# EAGLE design FlightPCB (EAGLE 9.6.2)
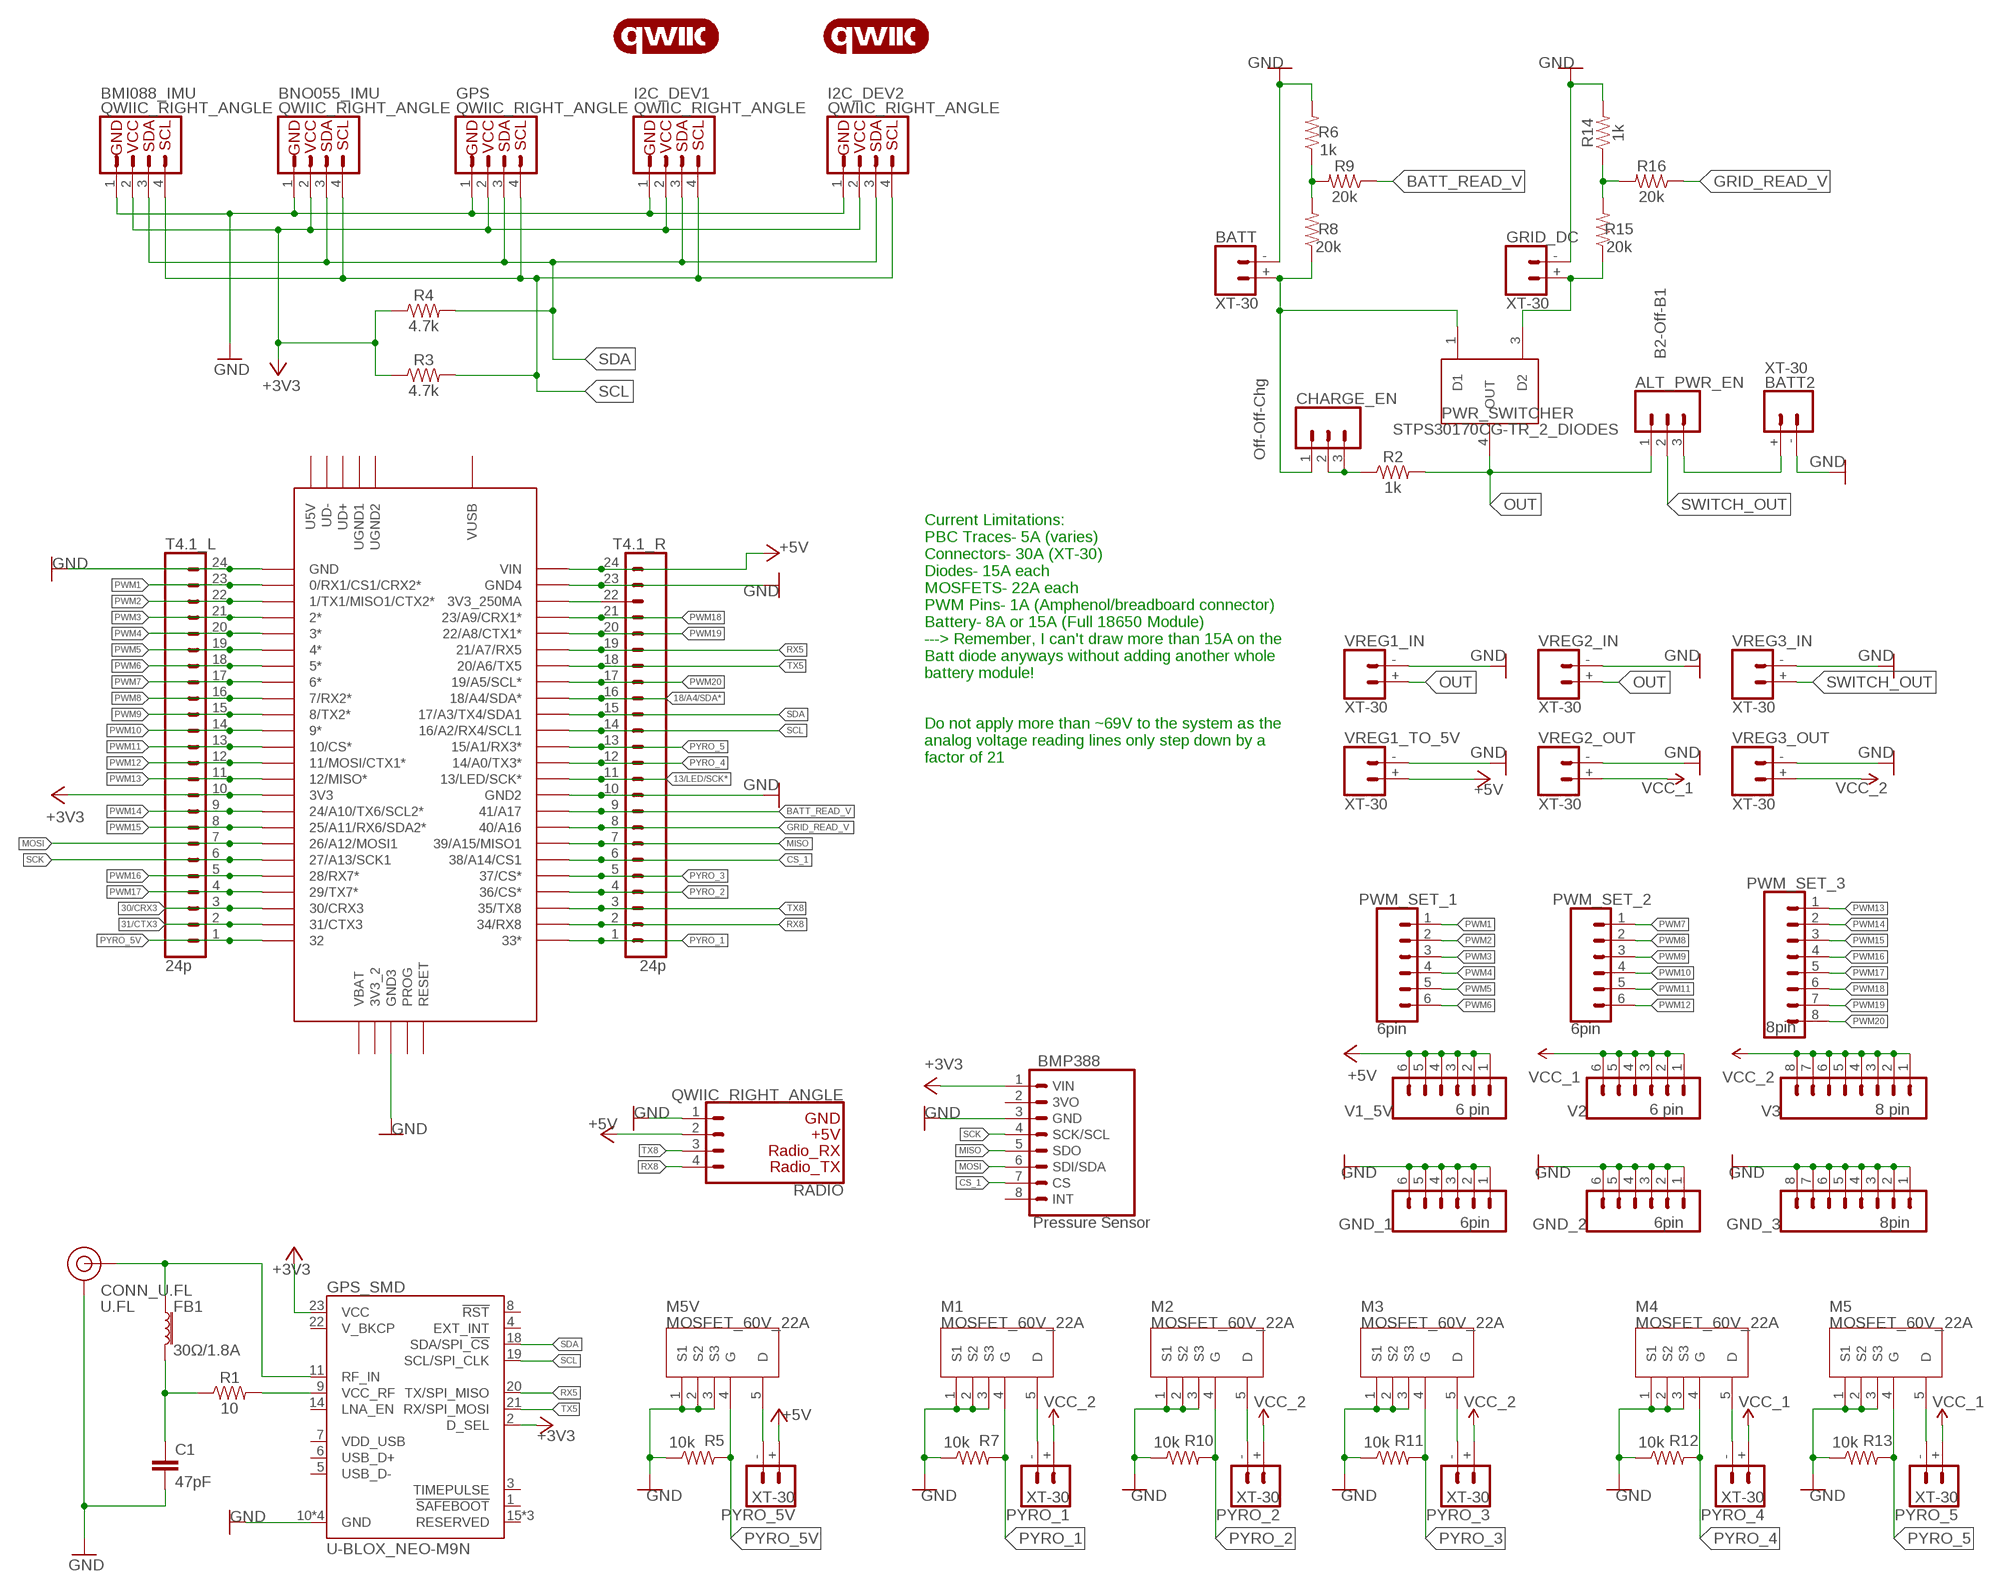
[diagram p0: schematic, sheet 1]

## Parts
ALT_PWR_EN  B2-Off-B1  CONN_03_SLIDE_SWITCH_EG5137  [1X03_SLIDE_SWITCH_EG5137]
BATT  XT-30  CONN_02_XT-30_CONNECTOR1X02_XT-30  [1X02_BIG_XT-30]
BATT2  XT-30  CONN_02_XT-30_CONNECTOR1X02_XT-30  [1X02_BIG_XT-30]
BMI088_IMU  QWIIC_RIGHT_ANGLE  QWIIC_CONNECTORJS-1MM  [JST04_1MM_RA]
BMP388  Pressure Sensor  CONN_08_BMP388_MODIFIEDFEMALE_LOCK  [1X08_FEMALE_LOCK]
BNO055_IMU  QWIIC_RIGHT_ANGLE  QWIIC_CONNECTORJS-1MM  [JST04_1MM_RA]
C1  47pF  47PF-0603-50V-5%  [0603]
CHARGE_EN  Off-Off-Chg  CONN_03_SLIDE_SWITCH_EG5137  [1X03_SLIDE_SWITCH_EG5137]
CONN_U.FL  U.FL  U.FL2PIN  [U.FL]
FB1  30Ω/1.8A  FERRITE_BEAD-0603  [0603]
GND_1  6pin  CONN_06LOCK  [1X06_LOCK]
GND_2  6pin  CONN_06LOCK  [1X06_LOCK]
GND_3  8pin  CONN_08LOCK  [1X08_LOCK]
GPS  QWIIC_RIGHT_ANGLE  QWIIC_CONNECTORJS-1MM  [JST04_1MM_RA]
GPS_SMD  U-BLOX_NEO-M9N  [NEO-M9N/M8T/M8U]
GRID_DC  XT-30  CONN_02_XT-30_CONNECTOR1X02_XT-30  [1X02_BIG_XT-30]
I2C_DEV1  QWIIC_RIGHT_ANGLE  QWIIC_CONNECTORJS-1MM  [JST04_1MM_RA]
I2C_DEV2  QWIIC_RIGHT_ANGLE  QWIIC_CONNECTORJS-1MM  [JST04_1MM_RA]
LOGO1  QWIIC_LOGO_CONNECTOR  [QWIIC_5.5MM]
LOGO2  QWIIC_LOGO_CONNECTOR  [QWIIC_5.5MM]
M1  MOSFET_60V_22A  [TO127P600X120-5N]
M2  MOSFET_60V_22A  [TO127P600X120-5N]
M3  MOSFET_60V_22A  [TO127P600X120-5N]
M4  MOSFET_60V_22A  [TO127P600X120-5N]
M5  MOSFET_60V_22A  [TO127P600X120-5N]
M5V  MOSFET_60V_22A  [TO127P600X120-5N]
PWM_SET_1  6pin  CONN_06LOCK  [1X06_LOCK]
PWM_SET_2  6pin  CONN_06LOCK  [1X06_LOCK]
PWM_SET_3  8pin  CONN_08LOCK  [1X08_LOCK]
PWR_SWITCHER  STPS30170CG-TR_2_DIODES  [TO-263-3_PACKAGE_MIDDLE_PIN_REMOVED]
PYRO_1  XT-30  CONN_02_XT-30_CONNECTOR1X02_XT-30  [1X02_BIG_XT-30]
PYRO_2  XT-30  CONN_02_XT-30_CONNECTOR1X02_XT-30  [1X02_BIG_XT-30]
PYRO_3  XT-30  CONN_02_XT-30_CONNECTOR1X02_XT-30  [1X02_BIG_XT-30]
PYRO_4  XT-30  CONN_02_XT-30_CONNECTOR1X02_XT-30  [1X02_BIG_XT-30]
PYRO_5  XT-30  CONN_02_XT-30_CONNECTOR1X02_XT-30  [1X02_BIG_XT-30]
PYRO_5V  XT-30  CONN_02_XT-30_CONNECTOR1X02_XT-30  [1X02_BIG_XT-30]
R1  10  10OHM-0603-1/10W-1%  [0603]
R2  1k  1KOHM-0603-1/10W-1%  [0603]
R3  4.7k  4.7KOHM-0603-1/10W-1%  [0603]
R4  4.7k  4.7KOHM-0603-1/10W-1%  [0603]
R5  10k  10KOHM-0603-1/10W-1%  [0603]
R6  1k  1KOHM-0603-1/10W-1%  [0603]
R7  10k  10KOHM-0603-1/10W-1%  [0603]
R8  20k  20KOHM-0603-1/10W-1%  [0603]
R9  20k  20KOHM-0603-1/10W-1%  [0603]
R10  10k  10KOHM-0603-1/10W-1%  [0603]
R11  10k  10KOHM-0603-1/10W-1%  [0603]
R12  10k  10KOHM-0603-1/10W-1%  [0603]
R13  10k  10KOHM-0603-1/10W-1%  [0603]
R14  1k  1KOHM-0603-1/10W-1%  [0603]
R15  20k  20KOHM-0603-1/10W-1%  [0603]
R16  20k  20KOHM-0603-1/10W-1%  [0603]
RADIO  QWIIC_RIGHT_ANGLE  QWIIC_CONNECTOR_SERIAL_RADIO_MODIFIEDJS-1MM  [JST04_1MM_RA]
T4.1_L  24p  CONN_24LOCK  [1X24_LOCK]
T4.1_R  24p  CONN_24LOCK  [1X24_LOCK]
TEENSY_4.1  TEENSY_4.1  [TEENSY_4.1]
V1_5V  6 pin  CONN_06LOCK  [1X06_LOCK]
V2  6 pin  CONN_06LOCK  [1X06_LOCK]
V3  8 pin  CONN_08LOCK  [1X08_LOCK]
VREG1_IN  XT-30  CONN_02_XT-30_CONNECTOR1X02_XT-30  [1X02_BIG_XT-30]
VREG1_TO_5V  XT-30  CONN_02_XT-30_CONNECTOR1X02_XT-30  [1X02_BIG_XT-30]
VREG2_IN  XT-30  CONN_02_XT-30_CONNECTOR1X02_XT-30  [1X02_BIG_XT-30]
VREG2_OUT  XT-30  CONN_02_XT-30_CONNECTOR1X02_XT-30  [1X02_BIG_XT-30]
VREG3_IN  XT-30  CONN_02_XT-30_CONNECTOR1X02_XT-30  [1X02_BIG_XT-30]
VREG3_OUT  XT-30  CONN_02_XT-30_CONNECTOR1X02_XT-30  [1X02_BIG_XT-30]

## Nets
13/LED/SCK*: T4.1_R.11 TEENSY_4.1.13/LED/SCK*
18/A4/SDA*: T4.1_R.16 TEENSY_4.1.18/A4/SDA*
30/CRX3: T4.1_L.3 TEENSY_4.1.30/CRX3
31/CTX3: T4.1_L.2 TEENSY_4.1.31/CTX3
+3V3: BMI088_IMU.2 BMP388.1(VIN) BNO055_IMU.2 GPS.2 GPS_SMD.2(D_SEL) GPS_SMD.23(VCC) I2C_DEV1.2 I2C_DEV2.2 R3.1 R4.1 T4.1_L.10 TEENSY_4.1.3V3
+5V: PYRO_5V.+ RADIO.2 T4.1_R.24 TEENSY_4.1.VIN V1_5V.1 V1_5V.2 V1_5V.3 V1_5V.4 V1_5V.5 V1_5V.6 VREG1_TO_5V.+
BATT_READ_V: R9.1 T4.1_R.9 TEENSY_4.1.41/A17
CS_1: BMP388.7(CS) T4.1_R.6 TEENSY_4.1.38/A14/CS1
GND: BATT2.- BATT.- BMI088_IMU.1 BMP388.3(GND) BNO055_IMU.1 C1.2 CONN_U.FL.1(GND) CONN_U.FL.2(GND) GND_1.1 GND_1.2 GND_1.3 GND_1.4 GND_1.5 GND_1.6 GND_2.1 GND_2.2 GND_2.3 GND_2.4 GND_2.5 GND_2.6 GND_3.1 GND_3.2 GND_3.3 GND_3.4 GND_3.5 GND_3.6 GND_3.7 GND_3.8 GPS.1 GPS_SMD.10(GND) GPS_SMD.12(GND) GPS_SMD.13(GND) GPS_SMD.24(GND) GRID_DC.- I2C_DEV1.1 I2C_DEV2.1 M1.1(S1) M1.2(S2) M1.3(S3) M2.1(S1) M2.2(S2) M2.3(S3) M3.1(S1) M3.2(S2) M3.3(S3) M4.1(S1) M4.2(S2) M4.3(S3) M5.1(S1) M5.2(S2) M5.3(S3) M5V.1(S1) M5V.2(S2) M5V.3(S3) R5.1 R6.2 R7.1 R10.1 R11.1 R12.1 R13.1 R14.2 RADIO.1 T4.1_L.24 T4.1_R.10 T4.1_R.23 TEENSY_4.1.GND TEENSY_4.1.GND2 TEENSY_4.1.GND3 TEENSY_4.1.GND4 VREG1_IN.- VREG1_TO_5V.- VREG2_IN.- VREG2_OUT.- VREG3_IN.- VREG3_OUT.-
GRID_READ_V: R16.1 T4.1_R.8 TEENSY_4.1.40/A16
MISO: BMP388.5(SDO) T4.1_R.7 TEENSY_4.1.39/A15/MISO1
MOSI: BMP388.6(SDI/SDA) T4.1_L.7 TEENSY_4.1.26/A12/MOSI1
N$1: CONN_U.FL.FEED(SIGNAL) FB1.1 GPS_SMD.11(RF_IN)
N$2: C1.1 FB1.2 R1.1
N$3: GPS_SMD.9(VCC_RF) R1.2
N$4: CHARGE_EN.2 CHARGE_EN.3 R2.1
N$5: ALT_PWR_EN.3 BATT2.+
N$6: R6.1 R8.2 R9.2
N$7: M5V.5(D) PYRO_5V.-
N$8: GRID_DC.+ PWR_SWITCHER.3(D2) R15.1
N$9: M1.5(D) PYRO_1.-
N$10: M2.5(D) PYRO_2.-
N$11: M3.5(D) PYRO_3.-
N$12: M4.5(D) PYRO_4.-
N$13: M5.5(D) PYRO_5.-
N$14: BATT.+ CHARGE_EN.1 PWR_SWITCHER.1(D1) R8.1
N$16: R14.1 R15.2 R16.2
N$66: T4.1_R.22 TEENSY_4.1.3V3_250MA
OUT: ALT_PWR_EN.1 PWR_SWITCHER.4(OUT) R2.2 VREG1_IN.+ VREG2_IN.+
PWM1: PWM_SET_1.1 T4.1_L.23 TEENSY_4.1.0/RX1/CS1/CRX2*
PWM2: PWM_SET_1.2 T4.1_L.22 TEENSY_4.1.1/TX1/MISO1/CTX2*
PWM3: PWM_SET_1.3 T4.1_L.21 TEENSY_4.1.2*
PWM4: PWM_SET_1.4 T4.1_L.20 TEENSY_4.1.3*
PWM5: PWM_SET_1.5 T4.1_L.19 TEENSY_4.1.4*
PWM6: PWM_SET_1.6 T4.1_L.18 TEENSY_4.1.5*
PWM7: PWM_SET_2.1 T4.1_L.17 TEENSY_4.1.6*
PWM8: PWM_SET_2.2 T4.1_L.16 TEENSY_4.1.7/RX2*
PWM9: PWM_SET_2.3 T4.1_L.15 TEENSY_4.1.8/TX2*
PWM10: PWM_SET_2.4 T4.1_L.14 TEENSY_4.1.9*
PWM11: PWM_SET_2.5 T4.1_L.13 TEENSY_4.1.10/CS*
PWM12: PWM_SET_2.6 T4.1_L.12 TEENSY_4.1.11/MOSI/CTX1*
PWM13: PWM_SET_3.1 T4.1_L.11 TEENSY_4.1.12/MISO*
PWM14: PWM_SET_3.2 T4.1_L.9 TEENSY_4.1.24/A10/TX6/SCL2*
PWM15: PWM_SET_3.3 T4.1_L.8 TEENSY_4.1.25/A11/RX6/SDA2*
PWM16: PWM_SET_3.4 T4.1_L.5 TEENSY_4.1.28/RX7*
PWM17: PWM_SET_3.5 T4.1_L.4 TEENSY_4.1.29/TX7*
PWM18: PWM_SET_3.6 T4.1_R.21 TEENSY_4.1.23/A9/CRX1*
PWM19: PWM_SET_3.7 T4.1_R.20 TEENSY_4.1.22/A8/CTX1*
PWM20 [Power Delivery]: PWM_SET_3.8 T4.1_R.17 TEENSY_4.1.19/A5/SCL*
PYRO_1: M1.4(G) R7.2 T4.1_R.1 TEENSY_4.1.33*
PYRO_2: M2.4(G) R10.2 T4.1_R.4 TEENSY_4.1.36/CS*
PYRO_3: M3.4(G) R11.2 T4.1_R.5 TEENSY_4.1.37/CS*
PYRO_4: M4.4(G) R12.2 T4.1_R.12 TEENSY_4.1.14/A0/TX3*
PYRO_5: M5.4(G) R13.2 T4.1_R.13 TEENSY_4.1.15/A1/RX3*
PYRO_5V: M5V.4(G) R5.2 T4.1_L.1 TEENSY_4.1.32
RX5: GPS_SMD.20(TX/SPI_MISO) T4.1_R.19 TEENSY_4.1.21/A7/RX5
RX8: RADIO.4 T4.1_R.2 TEENSY_4.1.34/RX8
SCK: BMP388.4(SCK/SCL) T4.1_L.6 TEENSY_4.1.27/A13/SCK1
SCL: BMI088_IMU.4 BNO055_IMU.4 GPS.4 GPS_SMD.19(SCL/SPI_CLK) I2C_DEV1.4 I2C_DEV2.4 R3.2 T4.1_R.14 TEENSY_4.1.16/A2/RX4/SCL1
SDA: BMI088_IMU.3 BNO055_IMU.3 GPS.3 GPS_SMD.18(SDA/SPI_!CS!) I2C_DEV1.3 I2C_DEV2.3 R4.2 T4.1_R.15 TEENSY_4.1.17/A3/TX4/SDA1
SWITCH_OUT: ALT_PWR_EN.2 VREG3_IN.+
TX5: GPS_SMD.21(RX/SPI_MOSI) T4.1_R.18 TEENSY_4.1.20/A6/TX5
TX8: RADIO.3 T4.1_R.3 TEENSY_4.1.35/TX8
VCC_1: PYRO_4.+ PYRO_5.+ V2.1 V2.2 V2.3 V2.4 V2.5 V2.6 VREG2_OUT.+
VCC_2: PYRO_1.+ PYRO_2.+ PYRO_3.+ V3.1 V3.2 V3.3 V3.4 V3.5 V3.6 V3.7 V3.8 VREG3_OUT.+
Unconnected: BMP388.2(3VO) BMP388.8(INT) GPS_SMD.1(!SAFEBOOT!) GPS_SMD.3(TIMEPULSE) GPS_SMD.4(EXT_INT) GPS_SMD.5(USB_D-) GPS_SMD.6(USB_D+) GPS_SMD.7(VDD_USB) GPS_SMD.8(!RST) GPS_SMD.14(LNA_EN) GPS_SMD.15(RESERVED) GPS_SMD.16(RESERVED) GPS_SMD.17(RESERVED) GPS_SMD.22(V_BKCP) TEENSY_4.1.3V3_2 TEENSY_4.1.PROG TEENSY_4.1.RESET TEENSY_4.1.U5V TEENSY_4.1.UD+ TEENSY_4.1.UD- TEENSY_4.1.UGND1 TEENSY_4.1.UGND2 TEENSY_4.1.VBAT TEENSY_4.1.VUSB

## Notes on the sheet
- Current Limitations:
  PBC Traces- 5A (varies)
  Connectors- 30A (XT-30)
  Diodes- 15A each
  MOSFETS- 22A each
  PWM Pins- 1A (Amphenol/breadboard connector)
  Battery- 8A or 15A (Full 18650 Module)
  ---> Remember, I can't draw more than 15A on the 
  Batt diode anyways without adding another whole
  battery module!
  
  
  Do not apply more than ~69V to the system as the 
  analog voltage reading lines only step down by a 
  factor of 21

## Library data of the parts
ALT_PWR_EN CHARGE_EN = MODIFIED-SparkFun-Connectors:CONN_03_SLIDE_SWITCH_EG5137: Multi connection point. Often used as Generic Header-pin footprint for 0.1 inch spaced/style header connections On any of the 0.1 inch spaced packages, you can populate with these: Break Away Headers - Straight <https://www.sparkfun.com/products/116> (PRT-00116) Break Away Male Headers - Right Angle <https://www.sparkfun.com/products/553> (PRT-00553) Female Headers <https://www.sparkfun.com/products/115> (PRT-00115) Break Away Headers - Machine Pin <https://www.sparkfun.com/products/117> (PRT-00117) Break Away Female Headers - Swiss Machine Pin <https://www.sparkfun.com/products/743> (PRT-00743) Stackable Header - 3 Pin (Female, 0.1") <https://www.sparkfun.com/products/13875> (PRT-13875) For SCREWTERMINALS and SPRING TERMINALS visit here: Screw Terimnals on SparkFun.com <https://www.sparkfun.com/search/results?term=Screw+Terminals> (5mm/3.5mm/2.54mm spacing) This device is also useful as a general connection point to wire up your design to another part of your project. Our various solder wires solder well into these plated through hole pads. Hook-Up Wire - Assortment (Stranded, 22 AWG) <https://www.sparkfun.com/products/11375> (PRT-11375) Hook-Up Wire - Assortment (Solid Core, 22 AWG) <https://www.sparkfun.com/products/11367> (PRT-11367) View the entire wire category on our website here <https://www.sparkfun.com/categories/141> Special notes: Molex polarized connector foot print use with SKU : PRT-08232 with associated crimp pins and housings.
BATT BATT2 GRID_DC PYRO_1-PYRO_5 PYRO_5V VREG1_IN VREG1_TO_5V VREG2_IN VREG2_OUT VREG3_IN VREG3_OUT = MODIFIED-SparkFun-Connectors:CONN_02_XT-30_CONNECTOR: Multi connection point. Often used as Generic Header-pin footprint for 0.1 inch spaced/style header connections On any of the 0.1 inch spaced packages, you can populate with these: Break Away Headers - Straight <https://www.sparkfun.com/products/116> (PRT-00116) Break Away Male Headers - Right Angle <https://www.sparkfun.com/products/553> (PRT-00553) Female Headers <https://www.sparkfun.com/products/115> (PRT-00115) Break Away Headers - Machine Pin <https://www.sparkfun.com/products/117> (PRT-00117) Break Away Female Headers - Swiss Machine Pin <https://www.sparkfun.com/products/743> (PRT-00743) For SCREWTERMINALS and SPRING TERMINALS visit here: Screw Terimnals on SparkFun.com <https://www.sparkfun.com/search/results?term=Screw+Terminals> (5mm/3.5mm/2.54mm spacing) This device is also useful as a general connection point to wire up your design to another part of your project. Our various solder wires solder well into these plated through hole pads. Hook-Up Wire - Assortment (Stranded, 22 AWG) <https://www.sparkfun.com/products/11375> (PRT-11375) Hook-Up Wire - Assortment (Solid Core, 22 AWG) <https://www.sparkfun.com/products/11367> (PRT-11367) View the entire wire category on our website here <https://www.sparkfun.com/categories/141> Special notes: Molex polarized connector foot print use with: PRT-08233 with associated crimp pins and housings. 2.54_SCREWTERM for use with PRT-10571. 3.5mm Screw Terminal footprints for PRT-08084 5mm Screw Terminal footprints for use with PRT-08432
BMI088_IMU BNO055_IMU GPS I2C_DEV1 I2C_DEV2 = MODIFIED-SparkFun-Connectors:QWIIC_CONNECTOR: SparkFun I2C Standard Qwiic Connector An SMD 1mm pitch JST connector makes it easy and quick (get it? Qwiic?) to connect I2C devices to each other. The Qwiic system <http://www.sparkfun.com/qwiic> enables fast and solderless connection between popular platforms and various sensors and actuators. We carry 200mm <https://www.sparkfun.com/products/14204>, 100mm <https://www.sparkfun.com/products/14205>, 50mm <https://www.sparkfun.com/products/14206>, and breadboard friendly <https://www.sparkfun.com/products/14207> Qwiic cables. We also offer 10 pcs strips <https://www.sparkfun.com/products/14323> the SMD connectors.; PROD_ID: CONN-13694
BMP388 = MODIFIED-SparkFun-Connectors:CONN_08_BMP388_MODIFIED: Multi connection point. Often used as Generic Header-pin footprint for 0.1 inch spaced/style header connections On any of the 0.1 inch spaced packages, you can populate with these: Break Away Headers - Straight <https://www.sparkfun.com/products/116> (PRT-00116) Break Away Male Headers - Right Angle <https://www.sparkfun.com/products/553> (PRT-00553) Female Headers <https://www.sparkfun.com/products/115> (PRT-00115) Break Away Headers - Machine Pin <https://www.sparkfun.com/products/117> (PRT-00117) Break Away Female Headers - Swiss Machine Pin <https://www.sparkfun.com/products/743> (PRT-00743) Arduino Stackable Header - 8 Pin <https://www.sparkfun.com/products/9279> (PRT-09279) For SCREWTERMINALS and SPRING TERMINALS visit here: Screw Terimnals on SparkFun.com <https://www.sparkfun.com/search/results?term=Screw+Terminals> (5mm/3.5mm/2.54mm spacing) This device is also useful as a general connection point to wire up your design to another part of your project. Our various solder wires solder well into these plated through hole pads. Hook-Up Wire - Assortment (Stranded, 22 AWG) <https://www.sparkfun.com/products/11375> (PRT-11375) Hook-Up Wire - Assortment (Solid Core, 22 AWG) <https://www.sparkfun.com/products/11367> (PRT-11367) View the entire wire category on our website here <https://www.sparkfun.com/categories/141> Special notes: Molex polarized connector foot print use with SKU : PRT-08231 with associated crimp pins and housings. 1MM SMD Version SKU: PRT-10208 NOTES ON THE VARIANTS LOCK and LOCK_LONGPADS... This footprint was designed to help hold the alignment of a through-hole component (i.e. 6-pin header) while soldering it into place. You may notice that each hole has been shifted either up or down by 0.005 of an inch from it's more standard position (which is a perfectly straight line). This slight alteration caused the pins (the squares in the middle) to touch the edges of the holes. Because they are alternating, it causes a "brace" to hold the component in place. 0.005 has proven to be the perfect amount of "off-center" position when using our standard breakaway headers. Although looks a little odd when you look at the bare footprint, once you have a header in there, the alteration is very hard to notice. Also,if you push a header all the way into place, it is covered up entirely on the bottom side.; PROD_ID: CONN-09233; SF_ID: PRT-09279
C1 = SparkFun-Capacitors:47PF: 47pF ceramic capacitors A capacitor is a passive two-terminal electrical component used to store electrical energy temporarily in an electric field.; PROD_ID: CAP-08913
CONN_U.FL = MODIFIED-SparkFun-Connectors:U.FL2PIN: SMD Antenna Connector - U.FL 2mm height, 3.0mm x 3.0mm receptacle size. SparkFun Products: SparkFun WiFi Shield - ESP8266 <https://www.sparkfun.com/products/13287> SparkFun ESP8266 Thing <https://www.sparkfun.com/products/13231> SparkFun MiniGen - Pro Mini Signal Generator Shield <https://www.sparkfun.com/products/11420>; PROD_ID: CONN-09193; SF_ID: WRL-09144
FB1 = SparkFun-Coils:FERRITE_BEAD: Ferrite Bead (blocks, cores, rings, chokes, etc.) Inductor with layers of ferrite used to suppress high frequencies. Often used to isolate high frequency noise. SparkFun Products: IOIO-OTG - V2.2 <https://www.sparkfun.com/products/13613> SparkFun SAMD21 Mini Breakout <https://www.sparkfun.com/products/13664> SparkFun 6 Degrees of Freedom Breakout - LSM6DS3 <https://www.sparkfun.com/products/13339> SparkFun SAMD21 Dev Breakout <https://www.sparkfun.com/products/13672>; PROD_ID: NDUC-13805
GND_1 GND_2 PWM_SET_1 PWM_SET_2 V1_5V V2 = MODIFIED-SparkFun-Connectors:CONN_06: Multi connection point. Often used as Generic Header-pin footprint for 0.1 inch spaced/style header connections On any of the 0.1 inch spaced packages, you can populate with these: Break Away Headers - Straight <https://www.sparkfun.com/products/116> (PRT-00116) Break Away Male Headers - Right Angle <https://www.sparkfun.com/products/553> (PRT-00553) Female Headers <https://www.sparkfun.com/products/115> (PRT-00115) Break Away Headers - Machine Pin <https://www.sparkfun.com/products/117> (PRT-00117) Break Away Female Headers - Swiss Machine Pin <https://www.sparkfun.com/products/743> (PRT-00743) Arduino Stackable Header - 6 Pin <https://www.sparkfun.com/products/9280> (PRT-09280) For SCREWTERMINALS and SPRING TERMINALS visit here: Screw Terimnals on SparkFun.com <https://www.sparkfun.com/search/results?term=Screw+Terminals> (5mm/3.5mm/2.54mm spacing) This device is also useful as a general connection point to wire up your design to another part of your project. Our various solder wires solder well into these plated through hole pads. Hook-Up Wire - Assortment (Stranded, 22 AWG) <https://www.sparkfun.com/products/11375> (PRT-11375) Hook-Up Wire - Assortment (Solid Core, 22 AWG) <https://www.sparkfun.com/products/11367> (PRT-11367) View the entire wire category on our website here <https://www.sparkfun.com/categories/141>
GND_3 PWM_SET_3 V3 = MODIFIED-SparkFun-Connectors:CONN_08: Multi connection point. Often used as Generic Header-pin footprint for 0.1 inch spaced/style header connections On any of the 0.1 inch spaced packages, you can populate with these: Break Away Headers - Straight <https://www.sparkfun.com/products/116> (PRT-00116) Break Away Male Headers - Right Angle <https://www.sparkfun.com/products/553> (PRT-00553) Female Headers <https://www.sparkfun.com/products/115> (PRT-00115) Break Away Headers - Machine Pin <https://www.sparkfun.com/products/117> (PRT-00117) Break Away Female Headers - Swiss Machine Pin <https://www.sparkfun.com/products/743> (PRT-00743) Arduino Stackable Header - 8 Pin <https://www.sparkfun.com/products/9279> (PRT-09279) For SCREWTERMINALS and SPRING TERMINALS visit here: Screw Terimnals on SparkFun.com <https://www.sparkfun.com/search/results?term=Screw+Terminals> (5mm/3.5mm/2.54mm spacing) This device is also useful as a general connection point to wire up your design to another part of your project. Our various solder wires solder well into these plated through hole pads. Hook-Up Wire - Assortment (Stranded, 22 AWG) <https://www.sparkfun.com/products/11375> (PRT-11375) Hook-Up Wire - Assortment (Solid Core, 22 AWG) <https://www.sparkfun.com/products/11367> (PRT-11367) View the entire wire category on our website here <https://www.sparkfun.com/categories/141> Special notes: Molex polarized connector foot print use with SKU : PRT-08231 with associated crimp pins and housings. 1MM SMD Version SKU: PRT-10208 NOTES ON THE VARIANTS LOCK and LOCK_LONGPADS... This footprint was designed to help hold the alignment of a through-hole component (i.e. 6-pin header) while soldering it into place. You may notice that each hole has been shifted either up or down by 0.005 of an inch from it's more standard position (which is a perfectly straight line). This slight alteration caused the pins (the squares in the middle) to touch the edges of the holes. Because they are alternating, it causes a "brace" to hold the component in place. 0.005 has proven to be the perfect amount of "off-center" position when using our standard breakaway headers. Although looks a little odd when you look at the bare footprint, once you have a header in there, the alteration is very hard to notice. Also,if you push a header all the way into place, it is covered up entirely on the bottom side.
GPS_SMD = UNMODIFIED-SparkFun-GPS:U-BLOX_NEO-M9N: u-blox NEO-M9N GPS Module The NEO-M9N module is built on the robust u-blox M9 GNSS chip, which provides exceptional sensitivity and acquisition times for all L1 GNSS systems. The u-blox M9 standard precision GNSS platform, which delivers meter-level accuracy, succeeds the well-known u-blox M8 product range. The receiver also provides higher navigation rate and improved security features compared to previous u-blox GNSS generations. The NEO-M9N module is available in the NEO form factor LLC package; PROD_ID: IC-14651
LOGO1 LOGO2 = SparkFun-Aesthetics:QWIIC_LOGO: Qwiic Logos for placement on schematic and PCB. The 5.5mm silk logo is best for placing next to Qwiic connector.
M1-M5 M5V = BUK9Y43-60E:MOSFET
PWR_SWITCHER = TO-263-3_Diode_Rectifier:STPS30170CG-TR_2_DIODES
R1 = SparkFun-Resistors:10OHM: 10Ω resistor A resistor is a passive two-terminal electrical component that implements electrical resistance as a circuit element. Resistors act to reduce current flow, and, at the same time, act to lower voltage levels within circuits. - Wikipedia; PROD_ID: RES-12581
R2 R6 R14 = SparkFun-Resistors:1KOHM: 1kΩ resistor A resistor is a passive two-terminal electrical component that implements electrical resistance as a circuit element. Resistors act to reduce current flow, and, at the same time, act to lower voltage levels within circuits. - Wikipedia; PROD_ID: RES-07856
R3 R4 = SparkFun-Resistors:4.7KOHM: 4.7kΩ resistor A resistor is a passive two-terminal electrical component that implements electrical resistance as a circuit element. Resistors act to reduce current flow, and, at the same time, act to lower voltage levels within circuits. - Wikipedia; PROD_ID: RES-07857
R5 R7 R10-R13 = SparkFun-Resistors:10KOHM: 10kΩ resistor A resistor is a passive two-terminal electrical component that implements electrical resistance as a circuit element. Resistors act to reduce current flow, and, at the same time, act to lower voltage levels within circuits. - Wikipedia; PROD_ID: RES-00824
R8 R9 R15 R16 = SparkFun-Resistors:20KOHM: 20kΩ resistor A resistor is a passive two-terminal electrical component that implements electrical resistance as a circuit element. Resistors act to reduce current flow, and, at the same time, act to lower voltage levels within circuits. - Wikipedia; PROD_ID: RES-09383
RADIO = MODIFIED-SparkFun-Connectors:QWIIC_CONNECTOR_SERIAL_RADIO_MODIFIED: SparkFun I2C Standard Qwiic Connector An SMD 1mm pitch JST connector makes it easy and quick (get it? Qwiic?) to connect I2C devices to each other. The Qwiic system <http://www.sparkfun.com/qwiic> enables fast and solderless connection between popular platforms and various sensors and actuators. We carry 200mm <https://www.sparkfun.com/products/14204>, 100mm <https://www.sparkfun.com/products/14205>, 50mm <https://www.sparkfun.com/products/14206>, and breadboard friendly <https://www.sparkfun.com/products/14207> Qwiic cables. We also offer 10 pcs strips <https://www.sparkfun.com/products/14323> the SMD connectors.; PROD_ID: CONN-13694
T4.1_L T4.1_R = MODIFIED-SparkFun-Connectors:CONN_24: Multi connection point. Often used as Generic Header-pin footprint for 0.1 inch spaced/style header connections On any of the 0.1 inch spaced packages, you can populate with these: Break Away Headers - Straight <https://www.sparkfun.com/products/116> (PRT-00116) Break Away Male Headers - Right Angle <https://www.sparkfun.com/products/553> (PRT-00553) Female Headers <https://www.sparkfun.com/products/115> (PRT-00115) Break Away Headers - Machine Pin <https://www.sparkfun.com/products/117> (PRT-00117) Break Away Female Headers - Swiss Machine Pin <https://www.sparkfun.com/products/743> (PRT-00743) For SCREWTERMINALS and SPRING TERMINALS visit here: Screw Terimnals on SparkFun.com <https://www.sparkfun.com/search/results?term=Screw+Terminals> (5mm/3.5mm/2.54mm spacing) This device is also useful as a general connection point to wire up your design to another part of your project. Our various solder wires solder well into these plated through hole pads. Hook-Up Wire - Assortment (Stranded, 22 AWG) <https://www.sparkfun.com/products/11375> (PRT-11375) Hook-Up Wire - Assortment (Solid Core, 22 AWG) <https://www.sparkfun.com/products/11367> (PRT-11367) View the entire wire category on our website here <https://www.sparkfun.com/categories/141> Special notes: Molex polarized connector foot print use with SKU : PRT-08231 with associated crimp pins and housings. 1MM SMD Version SKU: PRT-10208 NOTES ON THE VARIANTS LOCK and LOCK_LONGPADS... This footprint was designed to help hold the alignment of a through-hole component (i.e. 6-pin header) while soldering it into place. You may notice that each hole has been shifted either up or down by 0.005 of an inch from it's more standard position (which is a perfectly straight line). This slight alteration caused the pins (the squares in the middle) to touch the edges of the holes. Because they are alternating, it causes a "brace" to hold the component in place. 0.005 has proven to be the perfect amount of "off-center" position when using our standard breakaway headers. Although looks a little odd when you look at the bare footprint, once you have a header in there, the alteration is very hard to notice. Also,if you push a header all the way into place, it is covered up entirely on the bottom side.
TEENSY_4.1 = Teensy4-1:TEENSY_4.1

## Net classes
1 Power Delivery: width 0.25 mm

## Board
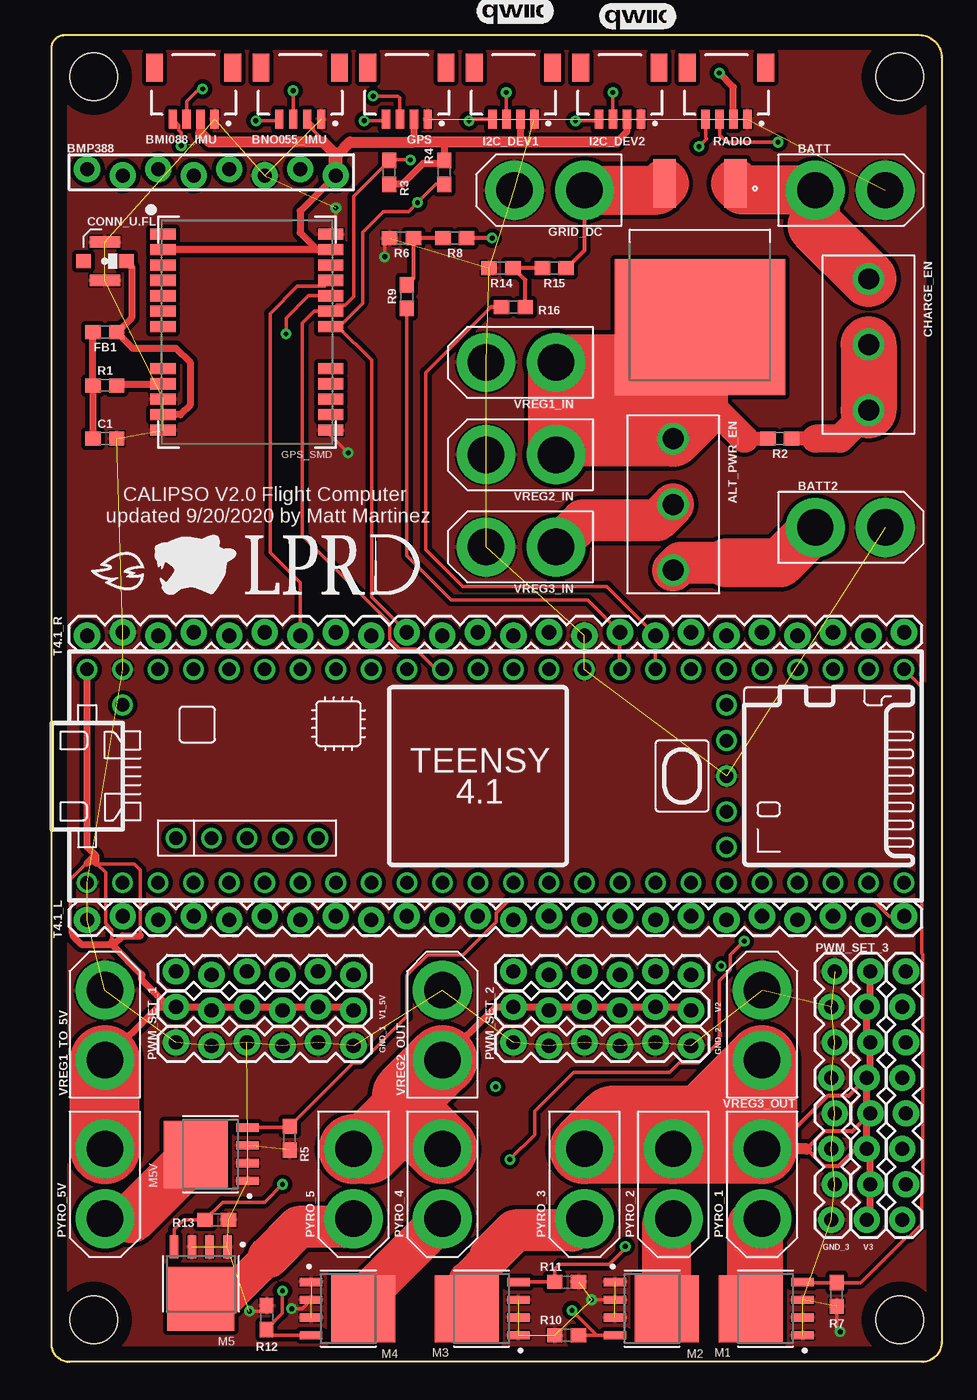
[diagram p1: board, top side]
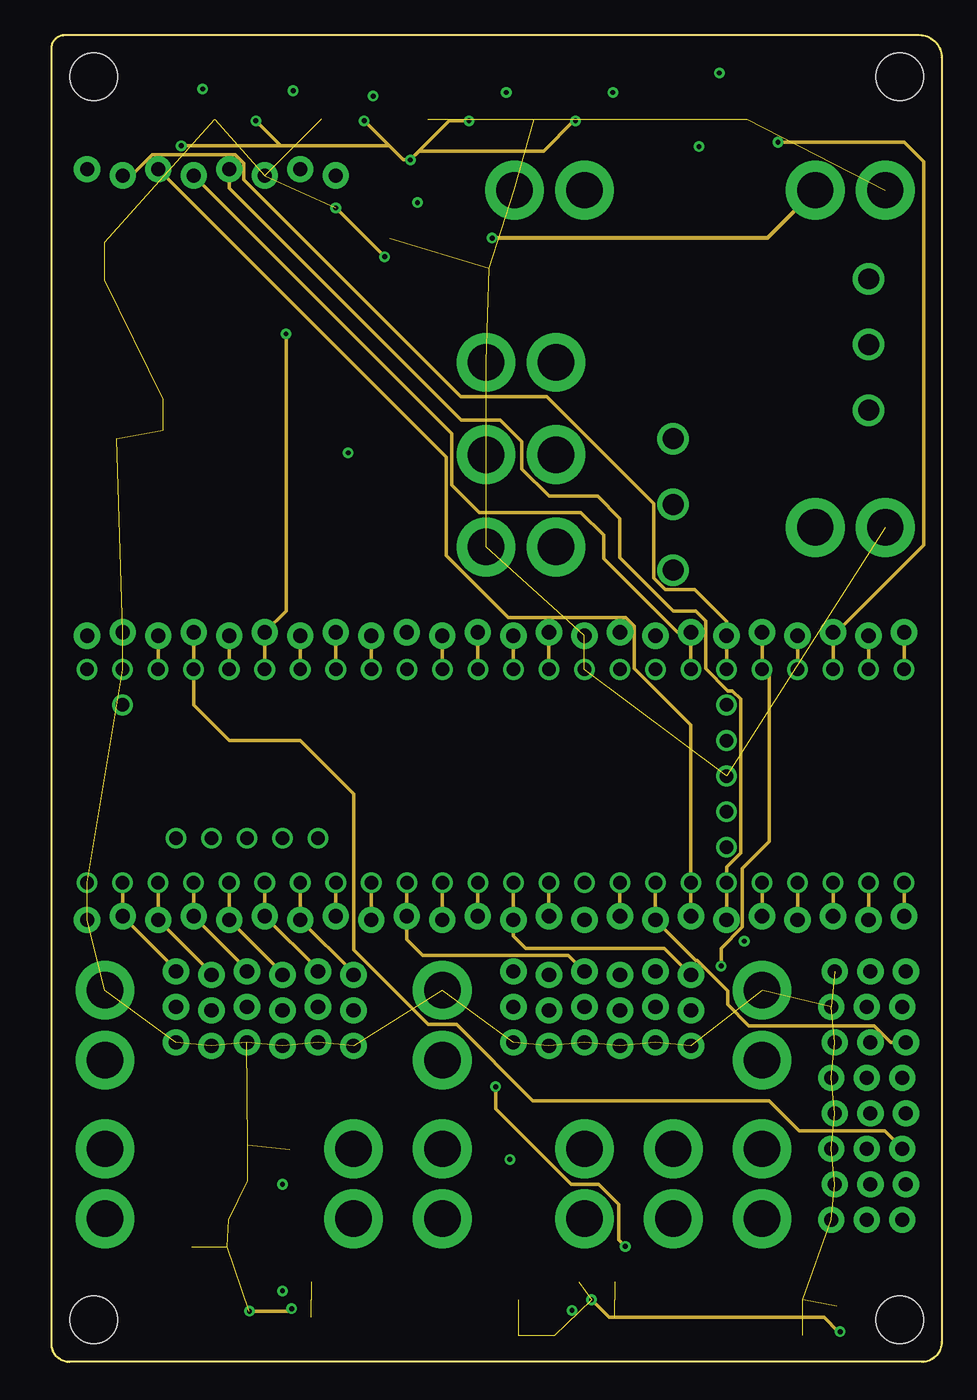
[diagram p2: board, inner layer Route2]
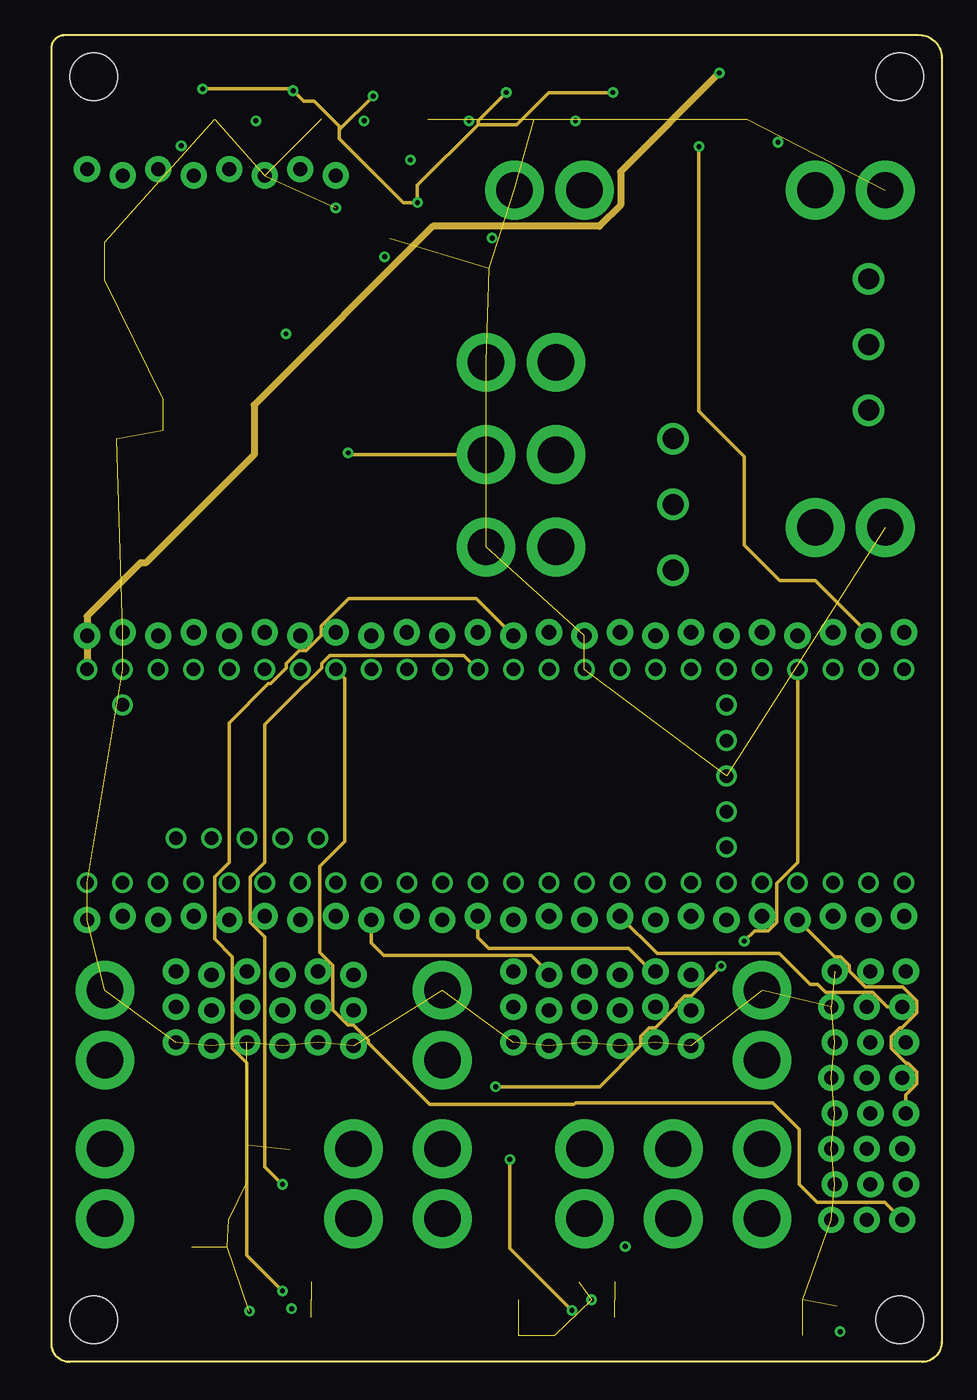
[diagram p3: board, inner layer Route15]
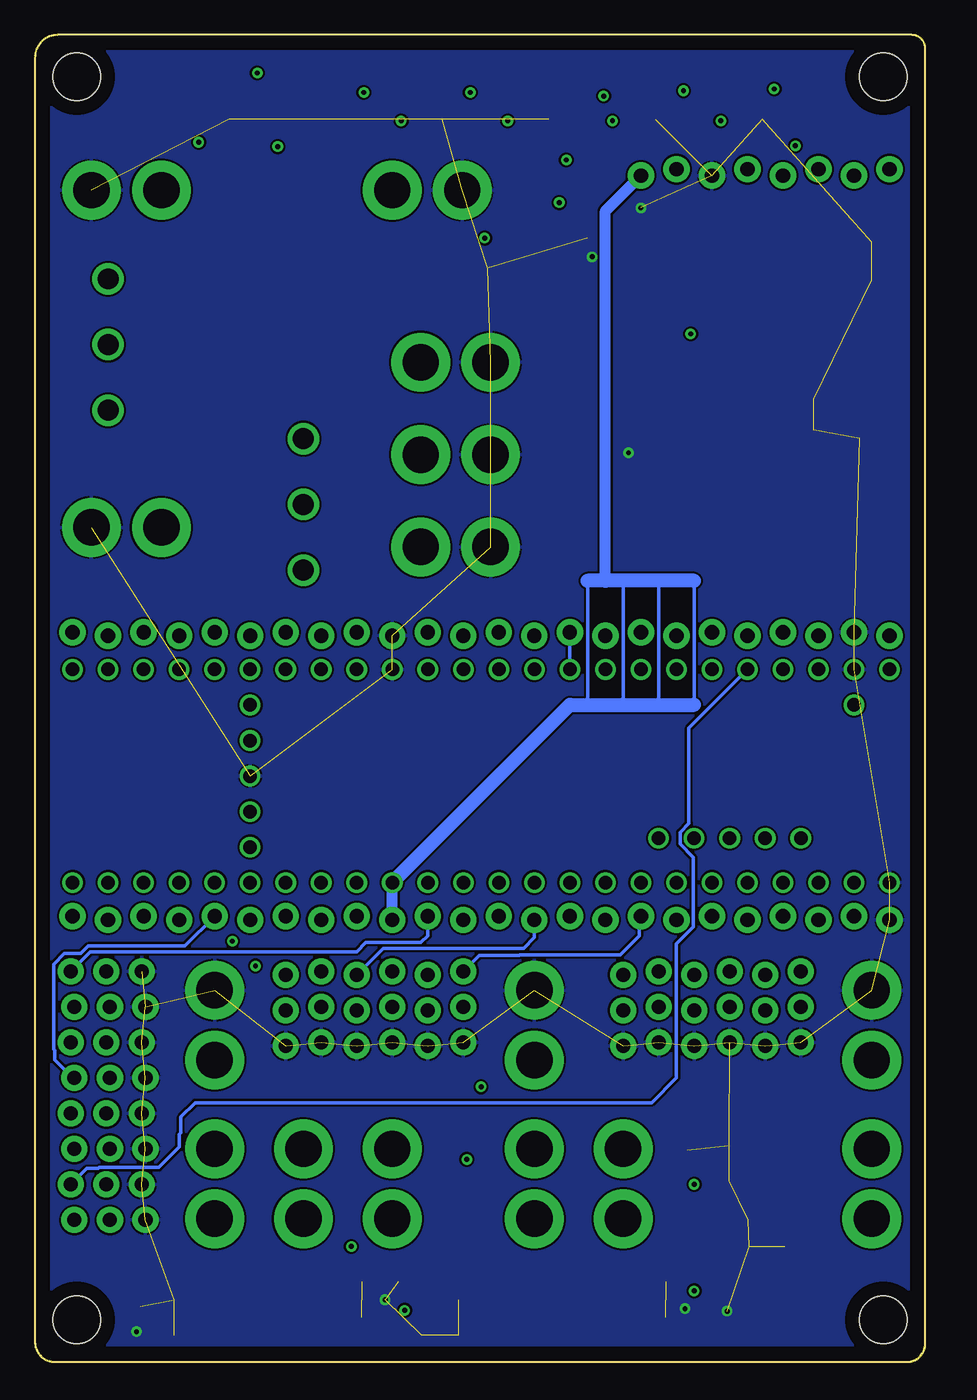
[diagram p4: board, bottom side, seen from below]

Size 63.65 x 94.92 mm. Coordinates in mm from the lower left corner, seen from the top.
Outline: 0,1.27 0,93.98 arc-90 0.94,94.92 62.03,94.92 arc-90 63.65,93.3 63.65,1.42 arc-90 62.23,0 1.27,0 arc-90 0,1.27
Copper layers (1+2*15+16): Top 0.035mm / dielectric 0.2mm / Route2 0.0175mm / dielectric 1.065mm / Route15 0.0175mm / dielectric 0.2mm / Bottom 0.035mm
Design rules "default *": minimum track width 6mil, minimum drill 0.35mm, track to track 6mil, track to pad 6mil, pad to pad 6mil, via to via 6mil, smd to smd 6mil, copper to edge 40mil, drill to drill 6mil, minimum pad ring 10mil, minimum via ring 8mil, stop-mask expansion 4mil, vias tented up to drill 0mil, thermal gap 5mil
Holes 3.4 mm at 3,3 60.65,3 60.65,91.92 3,91.92

### Footprints (pad centres in the part's own frame; a part is rotated, then mirrored left to right if it is on the bottom)
1X03_SLIDE_SWITCH_EG5137 = drill 1.5 pad 2.2: 1 0,0; 2 4.7,0; 3 9.4,0
1X02_BIG_XT-30 = drill 2.6 pad 4.2: + 0,0; - 5,0
JST04_1MM_RA = smd 0.6 x 1.35: 1 -1.5,0; 2 -0.5,0; 3 0.5,0; 4 1.5,0 | smd 1.2 x 2: NC1 2.8,-3.675; NC2 -2.8,-3.675
1X08_FEMALE_LOCK = drill 1.016 pad 1.88: 1 0,0.229; 2 2.54,-0.229; 3 5.08,0.229; 4 7.62,-0.229; 5 10.16,0.229; 6 12.7,-0.229; 7 15.24,0.229; 8 17.78,-0.229
0603 = smd 1.1 x 1: 1 -0.85,0; 2 0.85,0
U.FL = smd 2.2 x 0.85: 1 0,1.375; 2 0,-1.375 | smd 1.05 x 1: FEED 1.525,0; NC -1.525,0
1X06_LOCK = drill 1.016 pad 1.88: 1 0,0; 2 2.54,-0.254; 3 5.08,0; 4 7.62,-0.254; 5 10.16,0; 6 12.7,-0.254
1X08_LOCK = drill 1.016 pad 1.88: 1 0,0.127; 2 2.54,-0.127; 3 5.08,0.127; 4 7.62,-0.127; 5 10.16,0.127; 6 12.7,-0.127; 7 15.24,0.127; 8 17.78,-0.127
NEO-M9N/M8T/M8U = smd 1.8 x 0.8: 1 6,-7; 2 6,-5.9; 3 6,-4.8; 4 6,-3.7; 5 6,-2.6; 6 6,-1.5; 7 6,-0.4; 8 6,2.6; 9 6,3.7; 10 6,4.8; 11 6,5.9; 12 6,7; 13 -6,7; 14 -6,5.9; 15 -6,4.8; 16 -6,3.7; 17 -6,2.6; 18 -6,-0.4; 19 -6,-1.5; 20 -6,-2.6; 21 -6,-3.7; 22 -6,-4.8; 23 -6,-5.9; 24 -6,-7
TO127P600X120-5N = smd 0.6 x 1.62: 1 -1.905,-2.65; 2 -0.635,-2.65; 3 0.635,-2.65; 4 1.905,-2.65 | smd 4.8 x 4.58: 5 0,1.06
TO-263-3_PACKAGE_MIDDLE_PIN_REMOVED = smd 3.5 x 1.6: 1 -6.7,2.54; 3 -6.7,-2.54 | smd 9.75 x 12.2: 4 3.575,0
1X24_LOCK = drill 1.016 pad 1.88: 1 -26.67,-0.127; 2 -24.13,0.127; 3 -21.59,-0.127; 4 -19.05,0.127; 5 -16.51,-0.127; 6 -13.97,0.127; 7 -11.43,-0.127; 8 -8.89,0.127; 9 -6.35,-0.127; 10 -3.81,0.127; 11 -1.27,-0.127; 12 1.27,0.127; 13 3.81,-0.127; 14 6.35,0.127; 15 8.89,-0.127; 16 11.43,0.127; 17 13.97,-0.127; 18 16.51,0.127; 19 19.05,-0.127; 20 21.59,0.127; 21 24.13,-0.127; 22 26.67,0.127; 23 29.21,-0.127; 24 31.75,0.127
TEENSY_4.1 = drill 0.965: 0/RX1/CS1/CRX2* -25.4,-7.62; 1/TX1/MISO1/CTX2* -22.86,-7.62; 2* -20.32,-7.62; 3* -17.78,-7.62; 3V3 7.62,-7.62; 3V3_2 17.78,-2.54; 3V3_250MA -22.86,7.62; 4* -15.24,-7.62; 5* -12.7,-7.62; 6* -10.16,-7.62; 7/RX2* -7.62,-7.62; 8/TX2* -5.08,-7.62; 9* -2.54,-7.62; 10/CS* 0,-7.62; 11/MOSI/CTX1* 2.54,-7.62; 12/MISO* 5.08,-7.62; 13/LED/SCK* 5.08,7.62; 14/A0/TX3* 2.54,7.62; 15/A1/RX3* 0,7.62; 16/A2/RX4/SCL1 -2.54,7.62; 17/A3/TX4/SDA1 -5.08,7.62; 18/A4/SDA* -7.62,7.62; 19/A5/SCL* -10.16,7.62; 20/A6/TX5 -12.7,7.62; 21/A7/RX5 -15.24,7.62; 22/A8/CTX1* -17.78,7.62; 23/A9/CRX1* -20.32,7.62; 24/A10/TX6/SCL2* 10.16,-7.62; 25/A11/RX6/SDA2* 12.7,-7.62; 26/A12/MOSI1 15.24,-7.62; 27/A13/SCK1 17.78,-7.62; 28/RX7* 20.32,-7.62; 29/TX7* 22.86,-7.62; 30/CRX3 25.4,-7.62; 31/CTX3 27.94,-7.62; 32 30.48,-7.62; 33* 30.48,7.62; 34/RX8 27.94,7.62; 35/TX8 25.4,7.62; 36/CS* 22.86,7.62; 37/CS* 20.32,7.62; 38/A14/CS1 17.78,7.62; 39/A15/MISO1 15.24,7.62; 40/A16 12.7,7.62; 41/A17 10.16,7.62; GND -27.94,-7.62; GND2 7.62,7.62; GND3 17.78,0; GND4 -25.4,7.62; PROG 17.78,2.54; RESET 17.78,5.08; U5V -21.59,-4.445; UD+ -16.51,-4.445; UD- -19.05,-4.445; UGND1 -13.97,-4.445; UGND2 -11.43,-4.445; VBAT 17.78,-5.08; VIN -27.94,7.62; VUSB -25.4,5.08

### Placement (x,y rotation side)
ALT_PWR_EN  44.45,66.04 270 top
BATT  54.61,83.82 0 top
BATT2  54.61,59.69 0 top
BMI088_IMU  10.16,88.9 180 top
BMP388  20.32,85.09 180 top
BNO055_IMU  17.78,88.9 180 top
C1  3.81,66.04 0 top
CHARGE_EN  58.42,77.47 270 top
CONN_U.FL  3.81,78.74 0 top
FB1  3.81,73.66 180 top
GND_1  8.89,22.86 0 top
GND_2  33.02,22.86 0 top
GND_3  55.88,27.94 270 top
GPS  25.4,88.9 180 top
GPS_SMD  13.97,73.66 180 top
GRID_DC  38.1,83.82 180 top
I2C_DEV1  33.02,88.9 180 top
I2C_DEV2  40.64,88.9 180 top
LOGO1  41.91,96.27 0 top
LOGO2  33.15,96.65 0 top
M1  51.05,3.81 90 top
M2  42.93,3.81 270 top
M3  30.73,3.81 90 top
M4  21.21,3.81 270 top
M5  10.67,5.59 180 top
M5V  11.36,14.86 90 top
PWM_SET_1  8.89,27.94 0 top
PWM_SET_2  33.02,27.94 0 top
PWM_SET_3  60.96,27.94 270 top
PWR_SWITCHER  46.35,77.6 270 top
PYRO_1  50.8,15.24 270 top
PYRO_2  44.45,15.24 270 top
PYRO_3  38.1,15.24 270 top
PYRO_4  27.94,15.24 270 top
PYRO_5  21.59,15.24 270 top
PYRO_5V  3.81,15.24 270 top
R1  3.81,69.85 0 top
R2  52.07,66.04 180 top
R3  24.13,85.09 90 top
R4  28.07,85.09 270 top
R5  17.02,16 90 top
R6  25.02,80.39 180 top
R7  56.13,4.83 90 top
R8  28.83,80.39 180 top
R9  25.4,76.2 90 top
R10  36.83,1.91 0 top
R11  36.83,5.71 180 top
R12  15.37,3.18 270 top
R13  11.81,10.16 180 top
R14  32.13,78.23 180 top
R15  35.94,78.23 180 top
R16  33.02,75.44 0 top
RADIO  48.26,88.9 180 top
T4.1_L  34.29,31.75 180 top
T4.1_R  34.29,52.07 180 top
TEENSY_4.1  30.48,41.91 0 top
V1_5V  8.89,25.4 0 top
V2  33.02,25.4 0 top
V3  58.42,27.94 270 top
VREG1_IN  36.07,71.5 180 top
VREG1_TO_5V  3.81,21.59 90 top
VREG2_IN  36.07,64.9 180 top
VREG2_OUT  27.94,21.59 90 top
VREG3_IN  36.07,58.29 180 top
VREG3_OUT  50.8,21.59 90 top

### Tracks (layer width: path | path; a pad name or v marks a point on that pad's centre or on a via)
13/LED/SCK*
  Route2 0.25: TEENSY_4.1.13/LED/SCK* T4.1_R.11
18/A4/SDA*
  Route2 0.25: TEENSY_4.1.18/A4/SDA* T4.1_R.16
30/CRX3
  Route2 0.25: T4.1_L.3 TEENSY_4.1.30/CRX3
31/CTX3
  Route2 0.25: T4.1_L.2 TEENSY_4.1.31/CTX3
+3V3
  Top 0.25: 18.99,79.56 GPS_SMD.23 | BNO055_IMU.2 18.7,88.48 18.7,88.11 20.32,86.49 BMP388.1
  Top 0.5: 10.66,87.89 BMI088_IMU.2 | BMP388.1 17.78,82.32 17.78,80.77 18.99,79.56 | GPS_SMD.23 GPS_SMD.2 | GPS.2 25.9,87.26 25.91,87.25 | I2C_DEV1.2 33.52,87.26 33.53,87.25 | I2C_DEV2.2 41.14,88 40.39,87.25 | 27.94,87.25 28.07,87.12 R4.1 27.85,85.73 26.54,85.73 25.06,84.24 R3.1
  Top 0.8: 40.39,87.25 33.53,87.25 27.94,87.25 25.91,87.25 21.34,87.25 20.45,86.36 20.32,86.36 19.43,87.25 11.3,87.25 10.66,87.89
  Top 1: BMP388.1 20.32,86.36
  Bottom 0.25: 16.51,46.99 16.51,55.88 | 19.05,46.99 19.05,55.88 | 21.59,46.99 21.59,55.88 | 24.13,55.88 24.13,46.99
  Bottom 0.8: T4.1_L.10 TEENSY_4.1.3V3 | 22.86,55.88 22.86,82.32 BMP388.1
  Bottom 1: TEENSY_4.1.3V3 25.4,46.99 24.13,46.99 21.59,46.99 19.05,46.99 16.51,46.99 | 16.51,55.88 22.86,55.88 24.13,55.88
+5V  (via drill 0.35)
  Top 0.25: 4.32,30.1 4.32,30.92 3.86,31.37 3.86,35 3.24,35.62 | 3.24,35.62 3.17,35.69 2.54,35.69 2.5,35.69 1.32,34.51 1.32,30.68 1.52,30.48 | 6.35,30.48 6.35,35.18 5.91,35.62 3.24,35.62
  Top 0.5: RADIO.2 48.76,91.19 v47.75,92.2 | TEENSY_4.1.VIN 2.54,36.83 3.17,36.2 | VREG1_TO_5V.+ 7.62,25.4 V1_5V.1 | V1_5V.1 11.18,25.4 V1_5V.2 11.68,25.4 V1_5V.3 16.26,25.4 V1_5V.4 16.76,25.4 V1_5V.5 21.34,25.4 V1_5V.6 | V1_5V.1 8.38,25.4 6.46,27.32 6.46,27.69 4.38,29.78 | 4.32,30.1 4.32,29.83 | 4.38,29.78 4.32,29.83 | 4.38,29.78 5.08,30.48 6.35,30.48 | 4.32,29.83 2.17,29.83 1.52,30.48 | 3.17,35.69 3.17,36.2 | 2.54,35.69 3.05,36.2 3.17,36.2
  Top 5: PYRO_5V.+ VREG1_TO_5V.+
  Route15 0.5: v47.75,92.2 40.69,85.14 40.69,82.75 39.17,81.23 27.26,81.23 14.48,68.45 14.48,64.9 6.73,57.15 6.35,57.15 2.54,53.34 T4.1_R.24 TEENSY_4.1.VIN
BATT_READ_V
  Top 0.25: R9.1 25.4,57.68 28.59,54.49 38.34,54.49 T4.1_R.9
  Top 0.3: TEENSY_4.1.41/A17 T4.1_R.9
CS_1
  Route2 0.25: TEENSY_4.1.38/A14/CS1 T4.1_R.6 48.26,52.96 45.98,55.24 43.87,55.24 43.05,56.06 43.05,61.4 35.4,69.04 29.26,69.04 13.74,84.56 13.74,85.75 13.13,86.36 10.19,86.36 10.17,86.34 8.07,86.34 8.05,86.36 7.19,86.36 5.69,84.86 BMP388.7
GND  (via drill 0.35)  (71 unrouted)
  Top 0.25: GPS_SMD.24 20.32,81.01 v20.32,82.55 | v23.81,79.06 23.81,80.03 R6.2 | v21.21,65.02 19.97,66.26 GPS_SMD.13 | R12.1 14.97,3.63 v14.15,3.63 | v17.17,3.81 17.92,3.81 M4.2 | M2.2 v38.61,4.45 | v56.39,2.16 56.13,2.41 R7.1
  Route2 0.25: v20.32,82.55 v23.81,79.06 | v14.15,3.63 16.99,3.63 v17.17,3.81 | v38.61,4.45 39.88,3.18 55.24,3.18 56.26,2.16 v56.39,2.16
  Route15 0.25: VREG2_IN.- 21.34,64.9 v21.21,65.02
  pour Top (isolate 0.305): -10.16,96.52 -7.62,99.06 71.12,99.06 74.93,95.25 74.93,-3.81 67.31,-11.43 -5.08,-11.43 -10.16,-6.35
  pour Bottom: -17.78,88.9 -17.78,93.98 -6.35,105.41 68.58,105.41 69.85,104.14 72.39,104.14 86.36,90.17 86.36,0 68.58,-17.78 -10.16,-17.78 -21.59,-6.35 -21.59,85.09
GRID_READ_V
  Top 0.25: 31.39,75.44 26.74,70.78 26.74,58.12 29.39,55.47 39.71,55.47 43.18,52 T4.1_R.8 TEENSY_4.1.40/A16
  Top 0.3: R16.1 31.39,75.44
MISO
  Route2 0.25: TEENSY_4.1.39/A15/MISO1 T4.1_R.7 44.73,52.2 39.47,57.45 39.47,59.13 37.85,60.75 30.59,60.75 28.61,62.73 28.61,66.41 BMP388.5
MOSI
  Route2 0.25: T4.1_L.7 TEENSY_4.1.26/A12/MOSI1 45.72,45.56 41.68,49.6 41.68,52.63 41.07,53.24 32.65,53.24 28.2,57.68 28.2,64.73 BMP388.6
N$1
  Top 0.5: CONN_U.FL.FEED 5.72,78.36 5.72,74.67 4.71,73.66 FB1.1 5.8,72.52 8.89,72.52 9.91,71.5 9.91,68.45 9.21,67.76 GPS_SMD.11
N$2
  Top 0.5: C1.1 R1.1 FB1.2
N$3
  Top 0.5: R1.2 4.77,69.96 GPS_SMD.9
N$4
  Top 1: 54.61,66.04 R2.1
  Top 2: CHARGE_EN.3 56.39,66.04 54.61,66.04
  Top 4: CHARGE_EN.2 CHARGE_EN.3
N$5
  Top 3: 48.26,57.15 44.96,57.15 ALT_PWR_EN.3
  Top 3.5: BATT2.+ 52.07,57.15 48.26,57.15
N$6
  Top 0.3: R8.2 R6.1 25.87,77.52 R9.2
N$7
  Top 2.5: PYRO_5V.- 5.68,10.24
  Top 3.5: 5.68,10.24 M5V.5
N$8
  Top 0.3: GRID_DC.+ 38.1,79.49 36.84,78.23
  Top 0.5: 36.84,78.23 R15.1
  Top 3.5: PWR_SWITCHER.3 43.34,83.82 GRID_DC.+
N$9
  Top 4: PYRO_1.- 50.29,9.73 50.29,4.11 M1.5
N$10
  Top 3.5: M2.5 43.99,9.78 PYRO_2.-
N$11
  Top 2.5: 31.37,7.62 29.67,5.93 M3.5
  Top 3: PYRO_3.- 37.26,9.4 33.15,9.4 31.37,7.62
N$12
  Top 3: PYRO_4.- 22.27,4.57 M4.5
N$13
  Top 2.5: 15.49,7.49 12.53,4.53 M5.5
  Top 3: PYRO_5.- 21,9.65 17.65,9.65 15.49,7.49
N$14  (via drill 0.35)
  Top 0.3: v31.5,80.39 R8.1
  Top 3.5: PWR_SWITCHER.1 49.37,83.82 BATT.+ 54.61,81.28
  Top 4: 54.61,81.28 CHARGE_EN.1
  Route2 0.3: BATT.+ 51.18,80.39 v31.5,80.39
N$16
  Top 0.3: R15.2 R14.1 33.03,78.23 33.87,77.39 R16.2
N$66
  Route2 0.25: TEENSY_4.1.3V3_250MA T4.1_R.22
OUT
  Top 1: 49.53,66.04 R2.2
  Top 2: 46.35,67.95 47.62,67.95 49.53,66.04
  Top 3: PWR_SWITCHER.4 44.58,72.24 44.58,68.71 38.1,68.71
  Top 4: PWR_SWITCHER.4 46.35,72.39 | 46.35,72.39 46.35,67.95 ALT_PWR_EN.1 37.21,66.04 VREG2_IN.+ VREG1_IN.+ 45.47,71.5 46.35,72.39
PWM1
  Route2 0.25: PWM_SET_1.1 8.89,28.07 T4.1_L.23 TEENSY_4.1.0/RX1/CS1/CRX2*
PWM2
  Route2 0.25: PWM_SET_1.2 11.43,27.81 T4.1_L.22 TEENSY_4.1.1/TX1/MISO1/CTX2*
PWM3
  Route2 0.25: PWM_SET_1.3 13.97,28.07 T4.1_L.21 TEENSY_4.1.2*
PWM4
  Route2 0.25: PWM_SET_1.4 16.51,27.81 T4.1_L.20 TEENSY_4.1.3*
PWM5
  Route2 0.25: PWM_SET_1.5 19.05,28.07 T4.1_L.19 TEENSY_4.1.4*
PWM6
  Route2 0.25: TEENSY_4.1.5* T4.1_L.18 21.59,27.81 PWM_SET_1.6
PWM7
  Route2 0.25: TEENSY_4.1.6* T4.1_L.17
  Bottom 0.25: T4.1_L.17 20.45,31.75 20.45,30.48 21.81,29.12 28.99,29.12 29.02,29.08 31.88,29.08 PWM_SET_2.1
PWM8
  Route2 0.25: TEENSY_4.1.7/RX2* T4.1_L.16
  Route15 0.25: T4.1_L.16 22.86,29.97 23.75,29.08 34.29,29.08 35.56,27.81 PWM_SET_2.2
PWM9
  Route2 0.25: TEENSY_4.1.8/TX2* T4.1_L.15 25.4,30.23 26.54,29.08 36.96,29.08 PWM_SET_2.3
PWM10
  Route2 0.25: TEENSY_4.1.9* T4.1_L.14
  Bottom 0.25: T4.1_L.14 27.94,30.35 28.7,29.59 38.73,29.59 PWM_SET_2.4
PWM11
  Route2 0.25: T4.1_L.13 TEENSY_4.1.10/CS*
  Route15 0.25: T4.1_L.13 30.48,30.35 31.24,29.59 41.27,29.59 42.93,27.94 PWM_SET_2.5
PWM12
  Route2 0.25: TEENSY_4.1.11/MOSI/CTX1* T4.1_L.12 33.02,30.48 33.91,29.59 43.81,29.59 PWM_SET_2.6
PWM13
  Route2 0.25: T4.1_L.11 TEENSY_4.1.12/MISO*
  Bottom 0.25: T4.1_L.11 35.56,30.48 36.05,29.99 39.98,29.99 40.64,29.34 59.69,29.34 PWM_SET_3.1
PWM14
  Route2 0.25: T4.1_L.9 TEENSY_4.1.24/A10/TX6/SCL2*
  Route15 0.25: T4.1_L.9 43.31,29.21 52.04,29.21 54.26,26.99 54.8,26.99 55.35,26.44 58.72,26.44 59.76,25.4 PWM_SET_3.2
PWM15
  Route2 0.25: TEENSY_4.1.25/A11/RX6/SDA2* T4.1_L.8 46.08,28.73 46.15,28.73 48.34,26.54 48.34,25.57 49.86,24.05 58.83,24.05 60.02,22.86 PWM_SET_3.3
PWM16
  Route2 0.25: T4.1_L.5 TEENSY_4.1.28/RX7*
  Bottom 0.25: T4.1_L.5 52.94,29.74 59.86,29.74 60.39,29.21 61.54,29.21 62.3,28.44 62.3,22.36 62.23,22.28 62.23,21.59 60.96,20.32 PWM_SET_3.4
PWM17
  Route2 0.25: T4.1_L.4 TEENSY_4.1.29/TX7*
  Route15 0.25: T4.1_L.4 55.98,28.98 56.44,28.98 57.05,28.37 57.05,27.97 58.17,26.84 60.86,26.84 61.87,25.83 61.87,24.97 60.8,23.9 60.66,23.9 60.05,23.29 60.05,22.43 61.12,21.36 61.26,21.36 61.87,20.75 61.87,19.89 61.09,19.1 PWM_SET_3.5
PWM18
  Route2 0.25: T4.1_R.21 10.16,49.66 TEENSY_4.1.23/A9/CRX1* 10.16,46.99 12.7,44.45 17.78,44.45 21.59,40.64 21.59,29.46 26.92,24.13 28.96,24.13 34.42,18.67 51.31,18.67 53.47,16.51 59.56,16.51 PWM_SET_3.6
PWM19
  Route2 0.25: TEENSY_4.1.22/A8/CTX1* T4.1_R.20
  Bottom 0.25: PWM_SET_3.7 59.94,13.84 59.12,13.84 59.05,13.92 54.79,13.92 53.33,15.38 53.33,16.29 53.21,16.4 53.21,17.53 52.2,18.54 27.18,18.54 26.8,18.54 19.56,18.54 17.78,20.32 17.78,29.9 16.56,31.12 16.56,36.08 17.52,37.05 17.52,37.89 16.89,38.52 16.89,45.34 TEENSY_4.1.22/A8/CTX1*
PWM20
  Route2 0.25: TEENSY_4.1.19/A5/SCL* T4.1_R.17
  Route15 0.25: PWM_SET_3.8 59.56,11.43 54.74,11.43 53.47,12.7 53.47,16.64 51.56,18.54 37.47,18.54 37.34,18.41 27.05,18.41 22.63,22.84 22.63,23.04 21.56,24.11 21.16,24.11 20.09,25.18 20.09,28.37 19.18,29.28 19.18,35.43 20.95,37.21 20.95,48.9 TEENSY_4.1.19/A5/SCL*
PYRO_1
  Top 0.25: M1.4 53.74,5.68 R7.2 57.87,5.68 61.14,8.94 61.34,8.94 62.23,9.84 62.23,12.12 62.3,12.2 62.3,29.14 62.23,29.21 62.23,48.26 TEENSY_4.1.33*
  Route2 0.25: T4.1_R.1 TEENSY_4.1.33*
PYRO_2  (via drill 0.35)
  Top 0.25: R10.2 M2.4 38.99,1.91 v37.21,3.68 | v32.77,14.48 34.54,16.26 34.54,17.91 37.34,20.7 44.2,20.7 44.88,21.39 46.22,21.39 47.75,22.92 47.75,27.27 48.53,28.05 48.53,29.1 v49.53,30.1
  Route2 0.25: T4.1_R.4 TEENSY_4.1.36/CS*
  Route15 0.25: v37.21,3.68 32.77,8.13 v32.77,14.48 | v49.53,30.1 50.27,30.84 51.23,30.84 51.84,31.45 51.84,34.22 53.34,35.72 TEENSY_4.1.36/CS*
PYRO_3  (via drill 0.35)
  Top 0.25: M3.4 R11.2 35.98,6.64 36.32,6.98 39.88,6.98 41.02,8.13 v41.02,8.26
  Route2 0.25: T4.1_R.5 TEENSY_4.1.37/CS* 51.31,49.02 51.31,37.21 49.4,35.31 49.4,31.12 47.88,29.59 v47.88,28.32 | v41.02,8.26 40.56,8.72 40.56,11.26 39.12,12.7 37.16,12.7 31.75,18.11 v31.75,19.69
  Route15 0.25: v47.88,28.32 45.74,26.19 45.29,26.19 44.68,25.58 44.68,25.43 43.15,23.9 42.75,23.9 42.14,23.29 42.14,22.64 39.19,19.69 v31.75,19.69
PYRO_4  (via drill 0.35)
  Top 0.25: v16.51,5.08 16.51,3.47 R12.2 15.79,1.91 M4.4
  Route2 0.25: TEENSY_4.1.14/A0/TX3* T4.1_R.12
  Route15 0.25: v16.51,5.08 13.97,7.62 13.97,21.39 12.93,22.43 12.93,28.98 11.66,30.25 11.66,34.69 12.7,35.72 12.7,45.72 15.5,48.52 15.66,48.52 16.77,49.62 16.77,49.95 17.72,50.9 18.21,50.9 19.28,51.97 19.28,52.63 21.26,54.61 30.35,54.61 T4.1_R.12
PYRO_5  (via drill 0.35)
  Top 0.25: M5.4 8.76,9.49 9.44,10.16 R13.2 12.23,11.43 15.24,11.43 v16.51,12.7
  Route2 0.25: TEENSY_4.1.15/A1/RX3* T4.1_R.13
  Route15 0.25: v16.51,12.7 15.24,13.97 15.24,30.41 14.2,31.45 14.2,34.69 15.24,35.72 15.24,45.59 18.16,48.52 18.2,48.52 19.31,49.62 19.31,49.95 19.9,50.55 29.46,50.55 TEENSY_4.1.15/A1/RX3*
PYRO_5V
  Top 0.25: M5V.4 16.93,16.76 R5.2 21.55,21.39 22.09,21.39 25.41,24.71 25.41,27.64 26.89,29.12 29.44,29.12 31.8,31.48 31.8,32.13 32.77,33.09 58.67,33.09 59.89,31.88 T4.1_L.1
  Route2 0.25: T4.1_L.1 TEENSY_4.1.32
RX5  (via drill 0.35)
  Top 0.25: GPS_SMD.20 18.35,76.26 16.76,74.68 v16.76,73.53
  Route2 0.25: TEENSY_4.1.21/A7/RX5 T4.1_R.19 16.76,53.72 v16.76,73.53
RX8  (via drill 0.35)
  Top 0.25: RADIO.4 46.76,87.61 46.86,87.5 v46.29,86.93
  Route2 0.25: T4.1_R.2 TEENSY_4.1.34/RX8
  Route15 0.25: v46.29,86.93 46.29,68.01 49.53,64.77 49.53,58.42 52.07,55.88 54.61,55.88 58.42,52.07 T4.1_R.2
SCK
  Route2 0.25: T4.1_L.6 TEENSY_4.1.27/A13/SCK1 48.26,35.4 49.27,36.41 49.27,47.41 48.68,48 48.35,48 46.76,49.6 46.76,53.01 46.05,53.72 44.45,53.72 40.64,57.53 40.64,60.33 39.05,61.92 35.57,61.92 33.61,63.88 33.61,65.84 32.09,67.36 29.29,67.36 12.7,83.95 BMP388.4
SCL  (via drill 0.35)
  Top 0.25: I2C_DEV2.4 39.01,88.77 v37.47,88.77 | v25.65,85.98 24.17,85.98 R3.2 21.59,83.4 21.59,76.19 20.98,75.58 20.39,75.58 GPS_SMD.19 18.77,75.16 17.91,74.3 17.91,59.12 24.18,52.84 24.18,51.69 24.9,50.98 26.05,50.98 27.5,49.53 TEENSY_4.1.16/A2/RX4/SCL1 | GPS.4 23.77,88.77 v22.35,88.77 | BMI088_IMU.4 9.08,88.48 9.08,88.11 9.27,87.92 v9.27,87 | BNO055_IMU.4 16.15,88.77 v14.61,88.77 | v29.84,88.77 29.97,88.9 I2C_DEV1.4
  Route2 0.25: v37.47,88.77 37.34,88.77 35.18,86.61 26.29,86.61 v25.65,85.98 | v29.84,88.77 28.45,88.77 v25.65,85.98 | v22.35,88.77 24.13,87 | 24.13,87 25.15,85.98 v25.65,85.98 | v9.27,87 16.38,87 | 16.38,87 24.13,87 | v14.61,88.77 16.38,87 | TEENSY_4.1.16/A2/RX4/SCL1 T4.1_R.14
SDA  (via drill 0.35)
  Top 0.25: T4.1_R.15 22.89,54.71 22.89,71.64 20.47,74.06 GPS_SMD.18 20.56,74.06 22.24,75.74 22.24,80.83 23.71,82.3 25.53,82.3 v26.16,82.93 27.47,84.24 R4.2 | BMI088_IMU.3 9.66,90.18 10.54,91.06 v10.79,91.06 | v17.27,90.93 v17.28,90.92 BNO055_IMU.3 | v32.51,90.81 32.52,90.8 I2C_DEV1.3 | v40.13,90.81 40.14,90.8 I2C_DEV2.3 | GPS.3 24.9,90.42 24.77,90.55 v22.99,90.55
  Route15 0.25: v32.51,90.81 30.5,88.79 30.5,88.5 | 30.5,88.5 26.16,84.16 v26.16,82.93 25.15,82.93 20.57,87.5 20.57,88.14 | v40.13,90.81 35.56,90.81 33.26,88.5 30.5,88.5 | v22.99,90.55 20.57,88.14 | 20.57,88.14 20.57,88.39 18.8,90.17 18.03,90.17 v17.27,90.93 17.14,91.06 v10.79,91.06
  Bottom 0.25: TEENSY_4.1.17/A3/TX4/SDA1 T4.1_R.15
SWITCH_OUT
  Top 3: ALT_PWR_EN.2 43.31,60.2 37.97,60.2 VREG3_IN.+
TX5
  Top 0.25: GPS_SMD.21 19.55,76.94 17.56,76.94 15.62,75 15.62,57.91 17.78,55.75 T4.1_R.18
  Route2 0.25: TEENSY_4.1.20/A6/TX5 T4.1_R.18
TX8  (via drill 0.35)
  Top 0.25: RADIO.3 47.76,87.75 48.26,87.25 v51.94,87.25
  Route2 0.25: v51.94,87.25 60.96,87.25 62.36,85.85 62.36,58.42 56.13,52.2 T4.1_R.3 TEENSY_4.1.35/TX8
VCC_1
  Top 0.5: VREG2_OUT.+ 31.75,25.4 V2.1 35.31,25.4 V2.2 35.81,25.4 V2.3 40.39,25.4 V2.4 40.89,25.4 V2.5 45.47,25.4 V2.6
  Top 5: VREG2_OUT.+ 25.4,19.05 25.4,18.03 | PYRO_5.+ 22.61,15.24 25.4,18.03 | PYRO_4.+ 25.4,17.78 25.4,18.03
VCC_2
  Top 0.3: V3.6 57.51,15.24 56.27,14 55.24,14 54,15.24 55.24,16.48 57.25,16.48 V3.5 | V3.4 56.99,19.02 55.49,19.02 51.71,15.24 PYRO_1.+
  Top 0.5: V3.8 58.55,10.41 V3.7 58.55,14.99 V3.6 58.29,17.53 V3.5 58.29,18.03 V3.4 58.55,20.57 V3.3 58.29,23.11 V3.2 58.55,25.65 V3.1
  Top 0.8: 54,15.24 PYRO_1.+
  Top 5: VREG3_OUT.+ PYRO_1.+ PYRO_2.+ PYRO_3.+ 40.13,17.27 46.48,17.27 VREG3_OUT.+

### Text on the board
tPlace: CALIPSO V2.0 Flight Computer / updated 9/20/2020 by Matt Martinez